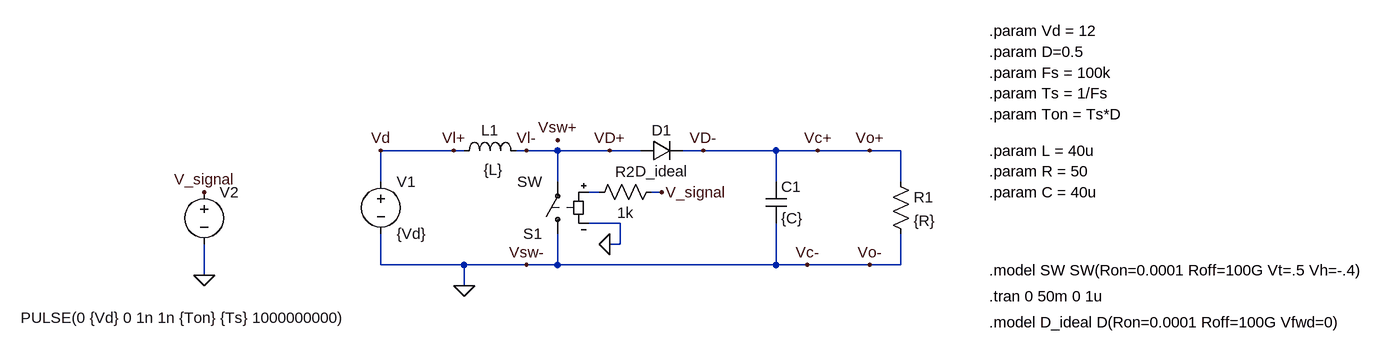
[diagram p0: schematic Boost_Ideal.asc]
Boost_Ideal.asc, the LTspice schematic file:
Version 4
SHEET 1 1140 680
WIRE -320 -64 -432 -64
WIRE -304 -64 -320 -64
WIRE -208 -64 -224 -64
WIRE -160 -64 -208 -64
WIRE -80 -64 -160 -64
WIRE -32 -64 -80 -64
WIRE 64 -64 32 -64
WIRE 176 -64 64 -64
WIRE 240 -64 176 -64
WIRE 320 -64 240 -64
WIRE 368 -64 320 -64
WIRE -432 -16 -432 -64
WIRE -160 -16 -160 -64
WIRE 176 -16 176 -64
WIRE 368 -16 368 -64
WIRE -96 0 -112 0
WIRE 0 0 -16 0
WIRE -64 48 -112 48
WIRE -64 80 -64 48
WIRE -64 80 -80 80
WIRE -432 112 -432 64
WIRE -304 112 -432 112
WIRE -208 112 -304 112
WIRE -160 112 -160 64
WIRE -160 112 -208 112
WIRE 176 112 176 48
WIRE 176 112 -160 112
WIRE 224 112 176 112
WIRE 320 112 224 112
WIRE 368 112 368 64
WIRE 368 112 320 112
WIRE -704 128 -704 80
WIRE -304 144 -304 112
FLAG -304 144 0
FLAG 0 0 V_signal
FLAG -80 80 0
FLAG -704 128 0
FLAG -704 0 V_signal
FLAG -432 -64 Vd
FLAG -160 -80 Vsw+
FLAG -208 112 Vsw-
FLAG -320 -64 Vl+
FLAG -80 -64 VD+
FLAG 64 -64 VD-
FLAG -208 -64 Vl-
FLAG 224 112 Vc-
FLAG 240 -64 Vc+
FLAG 320 -64 Vo+
FLAG 320 112 Vo-
SYMBOL diode -32 -48 R270
WINDOW 0 32 32 VTop 2
WINDOW 3 0 32 VBottom 2
SYMATTR InstName D1
SYMATTR Value D_ideal
SYMBOL res 352 -32 R0
SYMATTR InstName R1
SYMATTR Value {R}
SYMBOL cap 160 -16 R0
SYMATTR InstName C1
SYMATTR Value {C}
SYMBOL ind -320 -48 R270
WINDOW 0 32 56 VTop 2
WINDOW 3 2 61 VBottom 2
SYMATTR InstName L1
SYMATTR Value {L}
SYMBOL voltage -704 -16 R0
WINDOW 3 -282 209 Left 2
WINDOW 123 0 0 Left 0
WINDOW 39 0 0 Left 0
SYMATTR Value PULSE(0 {Vd} 0 1n 1n {Ton} {Ts} 1000000000)
SYMATTR InstName V2
SYMBOL sw -160 80 R180
SYMATTR InstName S1
SYMBOL voltage -432 -32 R0
WINDOW 123 0 0 Left 0
WINDOW 39 0 0 Left 0
SYMATTR InstName V1
SYMATTR Value {Vd}
SYMBOL res 0 -16 R90
WINDOW 0 0 56 VBottom 2
WINDOW 3 32 56 VTop 2
SYMATTR InstName R2
SYMATTR Value 1k
TEXT 504 -64 Left 2 !.param L = 40u
TEXT 504 -32 Left 2 !.param R = 50
TEXT 504 0 Left 2 !.param C = 40u
TEXT 504 160 Left 2 !.tran 0 50m 0 1u
TEXT 504 -248 Left 2 !.param Vd = 12
TEXT 504 -216 Left 2 !.param D=0.5
TEXT 504 -184 Left 2 !.param Fs = 100k
TEXT 504 -152 Left 2 !.param Ts = 1/Fs
TEXT 504 -120 Left 2 !.param Ton = Ts*D
TEXT 504 120 Left 2 !.model SW SW(Ron=0.0001 Roff=100G Vt=.5 Vh=-.4)
TEXT 504 200 Left 2 !.model D_ideal D(Ron=0.0001 Roff=100G Vfwd=0)

The netlist it stands for:
* Boost_Ideal.asc
D1 Vl- Vo+ D_ideal
R1 Vo+ 0 {R}
C1 Vo+ 0 {C}
L1 Vl+ Vl- {L}
V2 V_signal 0 PULSE(0 {Vd} 0 1n 1n {Ton} {Ts} 1000000000)
S1 0 Vl- N001 0 SW
V1 Vl+ 0 {Vd}
R2 V_signal N001 1k
.model D D
.lib standard.dio
.param L = 40u
.param R = 50
.param C = 40u
.tran 0 50m 0 1u
.param Vd = 12
.param D=0.5
.param Fs = 100k
.param Ts = 1/Fs
.param Ton = Ts*D
.model SW SW(Ron=0.0001 Roff=100G Vt=.5 Vh=-.4)
.model D_ideal D(Ron=0.0001 Roff=100G Vfwd=0)
.backanno
.end